# Altium schematic sheet Amp_8ch.SchDoc
size 594 x 420 mm; SheetNumber: 1; SheetTotal: 2
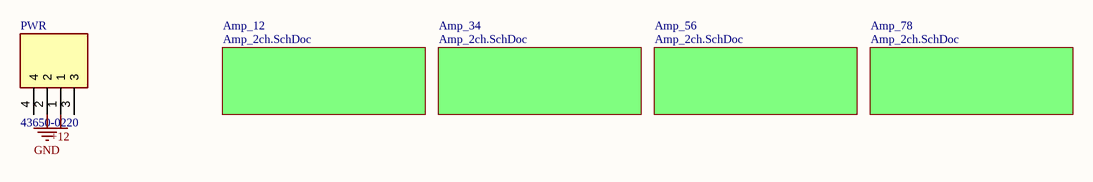
[diagram p0: Amp_8ch.SchDoc]

## Parts
PWR  43650-0220  [43650-02YY_18192063]

## Sub-sheets
Amp_12 = Amp_2ch.SchDoc: no entries
Amp_34 = Amp_2ch.SchDoc: no entries
Amp_56 = Amp_2ch.SchDoc: no entries
Amp_78 = Amp_2ch.SchDoc: no entries

## Nets
+12: PWR.1
GND: PWR.2

Not connected (* = marked no-connect by the designer): PWR 3 4

## Notes on the sheet
- DWG NO:
- REV:
- THIS DOCUMENT AND THE DATA DISCLOSED HEREIN OR
- HEREWITH IS THE PROPERTY OF ALTIUM LIMITED AND MAY
- BE FREELY DISTRIBUTED IN WHOLE. NO RIGHTS ARE
- RESERVED OR EXPRESS OR IMPLIED WARANTEE GIVEN.
- REVISION
- DESCRIPTION
- DATE
- APPROVED
- ENG:
- APPROVALS
- PROJECT
- DSN:
- CHK:
- REFERENCE DOCUMENTS
- PROJECT REVISION:
- TITLE
- DOCUMENT REVISION:
- DESIGN ITEM:
- BOM:
- FAB DWG:
- PCB DWG:
- ASSY DWG:
- SCALE:
- A2
- SIZE
- CAGE CODE
- FILE NAME
- DWG NO.
- SHEET
- OF
- REV

## Library data of the parts
PWR = 43650-0220: Connector; Manufacturer_Name: Molex; Datasheet Link: https://www.molex.com/pdm_docs/sd/436500218_sd.pdf; Height: 9.9mm; Manufacturer_Part_Number: 43650-0220; Mouser Part Number: 538-43650-0220; Mouser Price/Stock: https://www.mouser.co.uk/ProductDetail/Molex/43650-0220?qs=zhePCb1yaFPcr0mO6F%252BhcQ%3D%3D